# Altium schematic sheet PMIC (nPM1300).SchDoc: nPM1300-QEAA Ref. Layout Config. 1
size A4; Revision: 1.2; SheetNumber: 2; SheetTotal: 9; DocumentSize: A4; BoardTitle: nPM1300-QEAA Ref. Layout Config. 1; PCAName: nPM1300-QEAA; RefLayoutTitle: PMIC; Device: nPM1300-QEAA; Config: 1
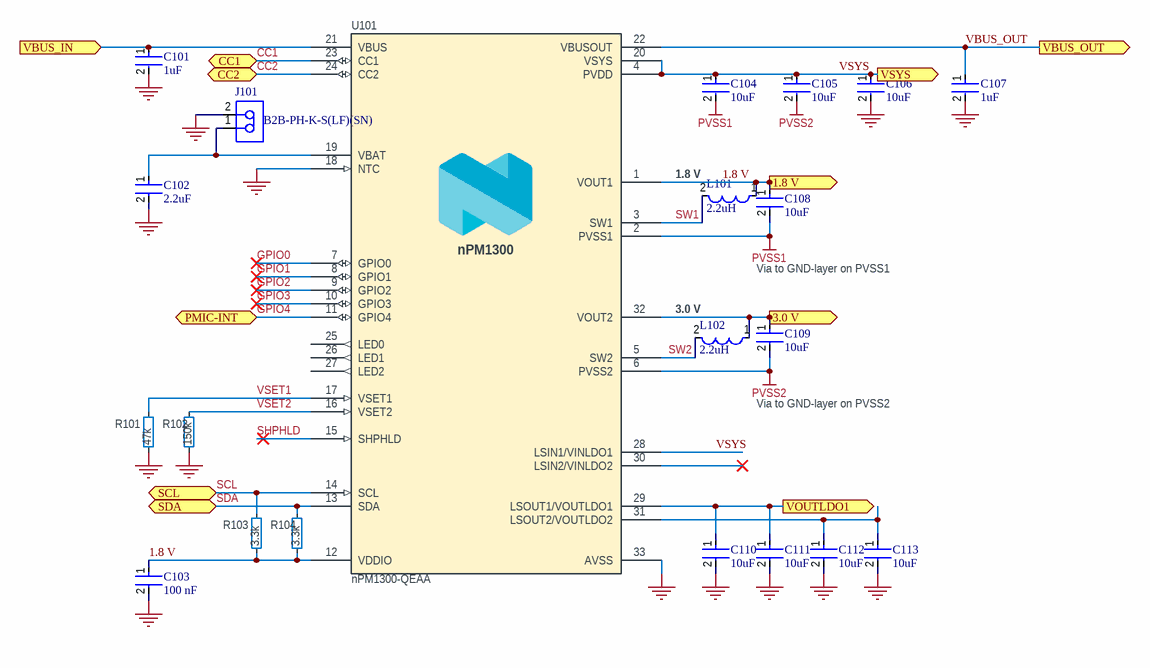
[diagram p0: PMIC (nPM1300).SchDoc]

## Parts
C101  1uF  [FP-CL10-IPC_C]
C102  2.2uF  [FP-GRM188-0_2-MFG]
C103  100 nF  [FP-CC0201-BA-MFG]
C104  10uF  [FP-GRM188-0_2-MFG]
C105  10uF  [FP-GRM188-0_2-MFG]
C106  10uF  [FP-GRM188-0_2-MFG]
C107  1uF  [FP-CL10-IPC_C]
C108  10uF  [FP-GRM188-0_2-MFG]
C109  10uF  [FP-GRM188-0_2-MFG]
C110  10uF  [FP-GRM188-0_2-MFG]
C111  10uF  [FP-GRM188-0_2-MFG]
C112  10uF  [FP-GRM188-0_2-MFG]
C113  10uF  [FP-GRM188-0_2-MFG]
J101  B2B-PH-K-S(LF)(SN)  [JST-B2B-PH-K-S_V]
L101  2.2uH  [FP-MLP2016M-IPC_B]
L102  2.2uH  [FP-MLP2016M-IPC_B]
R101  47k  [RESC0603X03L_C]
R102  150k  [RESC0603X03L_C]
R103  3.3k  [RESC0603X03L_C]
R104  3.3k  [RESC0603X03L_C]
U101  nPM1300-QEAA  [QFN32_5X5_NOR]

## Ports
1.8 V (out, see Digital_Watch[2B], IMU (BMI270)[1A], Level Shifter (PCA9306JKZ)[2B], PPG (MAX30102)[1A]), 3.0 V (out, see Digital_Watch[2B], GNNS (SAM-M10Q-00B)[1A], Level Shifter (PCA9306JKZ)[2B], MCU (nrf5340)[2A]), CC1 (bidir, see Digital_Watch[2B], USB-C[4B]), CC2 (bidir, see Digital_Watch[2B], USB-C[4B]), PMIC-INT (bidir, see Digital_Watch[2B], MCU (nrf5340)[4C]), SCL (bidir, see Digital_Watch[2B], IMU (BMI270)[1A], Level Shifter (PCA9306JKZ)[2B], MCU (nrf5340)[4C], PPG (MAX30102)[1A]), SDA (bidir, see Digital_Watch[2B], IMU (BMI270)[1B], Level Shifter (PCA9306JKZ)[2B], MCU (nrf5340)[4C], PPG (MAX30102)[1A]), VBUS_IN (in, see Digital_Watch[2B], USB-C[2B]), VBUS_OUT (out, see Digital_Watch[2B], MCU (nrf5340)[2A]), VOUTLDO1 (out, see Digital_Watch[2B], GNNS (SAM-M10Q-00B)[1B]), VSYS (out, see Digital_Watch[2B], PPG (MAX30102)[1B])

## Nets
GND: C101.2 C102.2 C103.2 C106.2 C107.2 C110.2 C111.2 C112.2 C113.2 J101.2 R101.2 R102.2 U101.18(NTC) U101.33(AVSS)
PVSS1: C104.2 C108.2 U101.2(PVSS1)
PVSS2: C105.2 C109.2 U101.6(PVSS2)
1.8 V: C103.1 C108.1 L101.1 R103.2 R104.2 U101.1(VOUT1) U101.12(VDDIO) ; port 1.8 V
3.0 V: C109.1 L102.1 U101.32(VOUT2) ; port 3.0 V
CC1: U101.23(CC1) ; port CC1
CC2: U101.24(CC2) ; port CC2
GPIO0: U101.7(GPIO0)
GPIO1: U101.8(GPIO1)
GPIO2: U101.9(GPIO2)
GPIO3: U101.10(GPIO3)
GPIO4: U101.11(GPIO4) ; port PMIC-INT
SCL: R103.1 U101.14(SCL) ; port SCL
SDA: R104.1 U101.13(SDA) ; port SDA
SHPHLD: U101.15(SHPHLD)
SW1: L101.2 U101.3(SW1)
SW2: L102.2 U101.5(SW2)
VBUS_IN: C101.1 U101.21(VBUS) ; port VBUS_IN
VBUS_OUT: C107.1 U101.22(VBUSOUT) ; port VBUS_OUT
VOUTLDO1: C110.1 C111.1 U101.29(LSOUT1/VOUTLDO1) ; port VOUTLDO1
VSET1: R101.1 U101.17(VSET1)
VSET2: R102.1 U101.16(VSET2)
VSYS: C104.1 C105.1 C106.1 U101.4(PVDD) U101.20(VSYS) U101.28(LSIN1/VINLDO1) ; port VSYS
NetC102_1: C102.1 J101.1 U101.19(VBAT)
NetC112_1: C112.1 C113.1 U101.31(LSOUT2/VOUTLDO2)

Not connected (* = marked no-connect by the designer): U101 25(LED0) 26(LED1) 27(LED2) 30(LSIN2/VINLDO2)*

## Notes on the sheet
- (near L101) 1.8 V
- (near L102) 3.0 V
- Via to GND-layer on PVSS1
- Via to GND-layer on PVSS2
- Title
- Size
- Date:
- File:
- A4
- Config. No.
- Device
- Sheet
- Drawn By:
- Revision
- of
- Nordic Semiconductor does not warrant the accuracy or completeness of this documentation or any included information. Nordic Semiconductor makes no assurances that this design will meet specification, be appropriate for your application, or fit for any particular purpose, or that it will function in an implementation. Nordic Semiconductor also does not claim that the design is ready for production. It is your responsibility to thoroughly validate and test your design implementation to confirm the functionality of your application.
  © Nordic Semiconductor — All rights reserved.
- Classification:
- (in symbol nPM1300_QEAA) nPM1300

## Library data of the parts
C101 C107 = CMP-13271-002233-1: Cap Ceramic 1uF 10V X5R ±10% Pad SMD 0603 +85°C T/R; Radiation Hardening: No; Height: 0.8mm; Dielectric: X5R; Capacitance: 1uF; Mount: Surface Mount; Length: 1.6mm; Package Quantity: 10000; Tolerance: 10%; Voltage: 10V; Thickness: 0.035inch; Packaging: Tape and Reel; Lead Free: Lead Free; Voltage Rating (DC): 10V; Width: 0.031inch; Voltage Rating: 10V; Case/Package: 0603; Min Operating Temperature: -55°C; Max Operating Temperature: 85°C; Depth: 0.8mm
C102 = CMP-06035-057307-1: Chip Multilayer Ceramic Capacitors for General Purpose, 0603, 2.2uF, X7R, 15%, 10%, 16V; Case/Package: 0603
C103 = CMP-03422-001239-1: CAP CER 0.1UF 16V X5R 0201; Manufacturer Part Number: CC0201KRX5R7BB104; Manufacturer: Yageo; Material: Ceramic; Temperature Coefficient: 15%; Tolerance: 0.1; Value: 100 nF; Capacitance: 100 nF; Temperature Range Low: -55°C; Footprint Url: http://www.yageo.com/exep/pages/download/literatures/UPY-C_GEN_24.pdf; Automotive: No; Temperature Characteristic: X5R; Digikey Description: CAP CER 0.1UF 16V X5R 0201; Temperature: -55°C to +85°C; RoHS: TRUE; Mouser Description: Multilayer Ceramic Capacitors MLCC - SMD/SMT 100K nF X5R 10% 16 Volts; Height: 0.33mm; Category: Cap; ComponentLink2Description: Datasheet; Lead Free: Yes; Ipc Land Pattern Name: CAPC6030X30; Device Class L2: Capacitors; Temperature Range High: +85°C; Octopart: https://octopart.com/cc0201krx5r7bb104-yageo-57080722; Device Class L3: Ceramic Capacitors; Device Class L1: Passive Components; Package: CC0201-BA; ComponentLink2URL: http://www.yageo.com/documents/recent/UPY-GPHC_X5R_4V-to-50V_25.pdf; Voltage Rating: 16 V
C104-C106 C108-C113 = CMP-2006-02520-2: Chip Multilayer Ceramic Capacitors for General Purpose, 0603, 10uF, X5R, 15%, 20%, 25V; Tolerance: 20%; Resistor Type: Ceramic; Voltage: 25V; Max Operating Temperature: 85°C; Min Operating Temperature: -55°C; Capacitance: 10uF; Dielectric: X5R; Lead Free: Lead Free; REACH SVHC: No SVHC; Case/Package: 0603; Mount: Surface Mount; Voltage Rating (DC): 25V; Height: 0.8mm; Length: 1.6mm; Thickness: 0.031inch; Width: 0.031inch; Termination: SMD/SMT; Case Code (Imperial): 0603; Case Code (Metric): 1608; Package Quantity: 1; Packaging: Tape and Reel; Depth: 0.8mm; Voltage Rating: 25V; Weight: 0.000222oz; Number of Pins: 2
J101 = CMP-2000-05162-1: Male Header, Pitch 2 mm, 1 x 2 Position, Height 6 mm, Tail Length 3.4 mm, -25 to 85 degC, RoHS, Bulk; Manufacturer: JST; Pitch: 2mm; Style/Orientation: StraightHeader/Plug; No of Positions: 2; Datasheet Version: Nov-08; Datasheet URL: http://datasheet.octopart.com/B2B-PH-K-S%28LF%29%28SN%29-JST-datasheet-8324864.pdf; Manufacturer URL: http://www.jst.com/home2.html; Type: ShroudedHeader; Termination: Crimp
L101 L102 = CMP-08253-000356-1: Shielded Multilayer Inductor 2.2uH ±20% 1200mA 143mΩ SMD 0806; DC Resistance (DCR): 143mR; Test Frequency: 2MHz; Current Rating: 1.2A; Core Material: Ferrite; Inductance: 2.2uH; Shielding: Shielded; Case Code (Imperial): 0806; Tolerance: 20%; Max Operating Temperature: 125°C; Case Code (Metric): 2016; Length: 0.079inch; RoHS Compliant: Yes; Case/Package: 0806; Packaging: Tape and Reel; Mount: Surface Mount; Width: 0.063inch; Package Quantity: 3000; Min Operating Temperature: -40°C; Height - Seated (Max): 0.039inch
R101-R104 = R0201: Resistor, ±1%, 0.05W; Pad Count: 2; Component Class: Resistors; Author: rsk; Footprint Doc: 0201
  R101: Value: 47k
  R102: Value: 150k
  R103 R104: Value: 3.3k
U101 = nPM1300_QEAA: Li-Ion/Li-Polymer USB-C battery charger with high efficiency buck regulators, LDOs or load switches, LED drivers, TWI and VBUSOUT; Manufacturer: Nordic Semiconductor; Part number NEMS: 102000291; Component Status: Active; Pad Count: 33; Note: N.A.; Part Number: nPM1300-QEAA; PartId: 102000291; Component Class: Nordic_Devices; Author: eisk; Manufacturer Part Number: nPM1300-QEAA; ComponentLink1URL: N.A.; ComponentLink1Description: Datasheet; ComponentLink2URL: N.A.; ComponentLink2Description: Supplier link; HelpURL: N.A.; LatestRevisionDate: 2023-05-25; Published: 2022-02-17; Footprint Doc: QFN-32; Value: nPM1300-QEAA; Supplier 1: Nordic Semiconductor; Supplier Part Number 1: nPM1300-QEAA; Supplier 2: N.A.; Supplier Part Number 2: N.A.; Artikkelnr Noca: N.A.; Part number IPS: N.A.; Part number Norautron: N.A.